# EAGLE design uSD_socket_breakout_rev_2 (EAGLE 6.5.0)
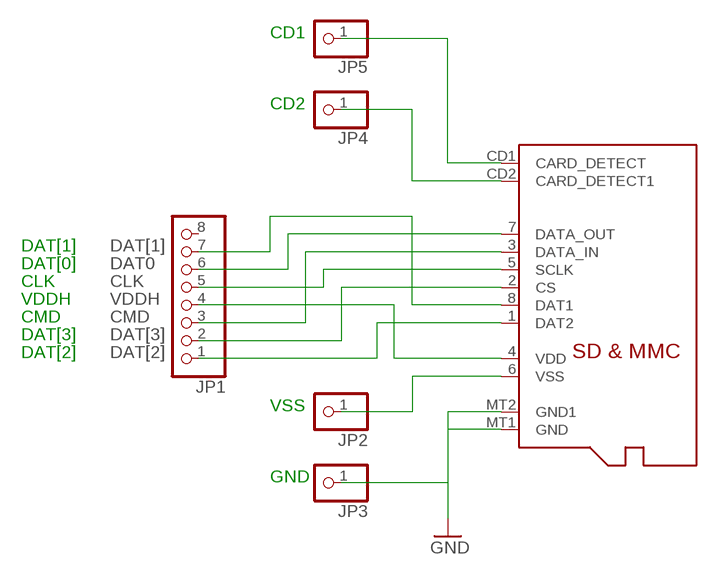
[diagram p0: schematic, sheet 1]

## Parts
JP1  PINHD-1X8CLEANBIG  [1X08-CLEANBIG]
JP2  PINHD-1X1CB  [1X01-CLEANBIG]
JP3  PINHD-1X1CB  [1X01-CLEANBIG]
JP4  PINHD-1X1CB  [1X01-CLEANBIG]
JP5  PINHD-1X1CB  [1X01-CLEANBIG]
U$1  MICROSD  [MICROSD]

## Nets
CLK: JP1.5 U$1.5(SCLK)
CMD: JP1.3 U$1.3(DATA_IN)
DAT0: JP1.6 U$1.7(DATA_OUT)
DAT[1]: JP1.7 U$1.8(DAT1)
DAT[2]: JP1.1 U$1.1(DAT2)
DAT[3]: JP1.2 U$1.2(CS)
GND: JP3.1 U$1.MT1(GND) U$1.MT2(GND1)
N$3: JP5.1 U$1.CD1(CARD_DETECT)
N$4: JP4.1 U$1.CD2(CARD_DETECT1)
VDDH: JP1.4 U$1.4(VDD)
VSS: JP2.1 U$1.6(VSS)
Unconnected: JP1.8

## Notes on the sheet
- CD1
- CD2
- DAT[1]
- DAT[0]
- CLK
- VDDH
- CMD
- DAT[3]
- DAT[2]
- VSS
- GND

## Library data of the parts
JP1 = adafruit:PINHD-1X8: PIN HEADER
JP2-JP5 = adafruit:PINHD-1X1: Pin header 1x1 for 0.1" spacing With round pins
U$1 = adafruit:MICROSD: Micro-SD / Transflash card holder with SPI pinout For the 3M # 2908-05WB-MG and/or 4UCON #19656 push-push type

## Board
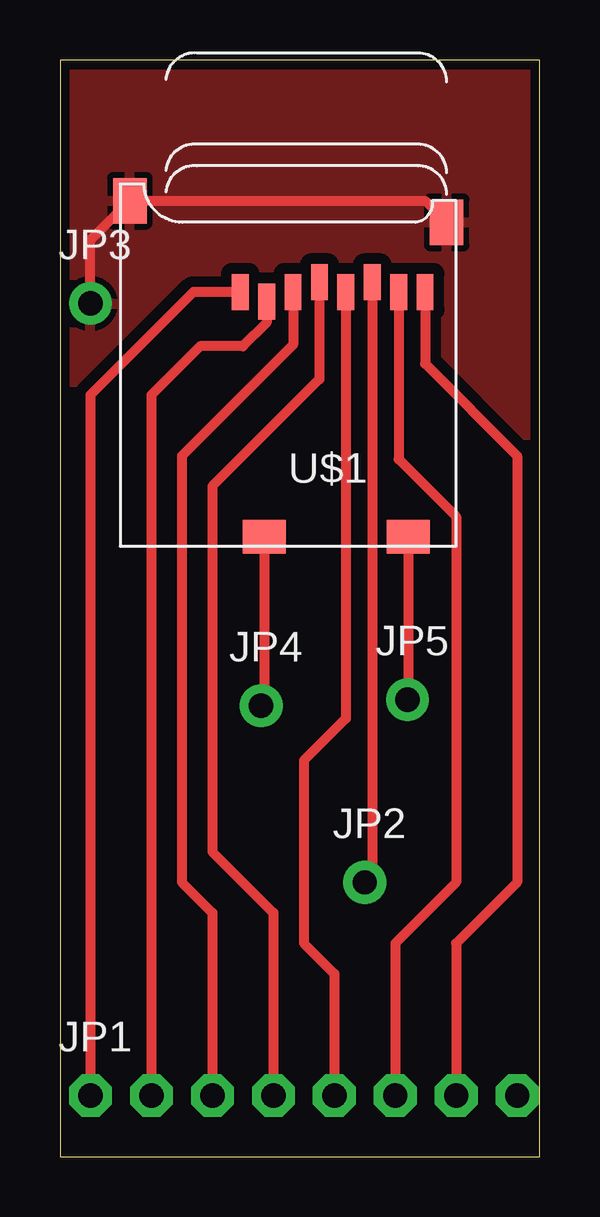
[diagram p1: board, top side]

Size 19.99 x 45.71 mm. Coordinates in mm from the lower left corner, seen from the top.
Outline: 0,0 19.99,0 19.99,45.71 0,45.71 0,0
Copper layers (1*16): Top 0.0178mm / dielectric 59mil / Bottom 0.0178mm
Design rules "epl-lpkf *": minimum track width 8mil, minimum drill 0.35mm, track to track 18mil, track to pad 18mil, pad to pad 18mil, via to via 18mil, smd to smd 8mil, copper to edge 15mil, drill to drill 15mil, minimum pad ring 8mil, minimum via ring 8mil, stop-mask expansion 3mil, vias tented up to drill 0mil, thermal gap 10mil

### Footprints (pad centres in the part's own frame; a part is rotated, then mirrored left to right if it is on the bottom)
1X08-CLEANBIG = drill 1.016 pad 1.778 octagon: 1 -8.89,0; 2 -6.35,0; 3 -3.81,0; 4 -1.27,0; 5 1.27,0; 6 3.81,0; 7 6.35,0; 8 8.89,0
1X01-CLEANBIG = drill 1.016 pad 1.778: 1 0,0
MICROSD = smd 0.7 x 1.5: 1 9,-10.64; 2 7.9,-10.24; 3 6.8,-10.64; 4 5.7,-11.04; 5 4.6,-10.64; 6 3.5,-11.04; 7 2.4,-10.64; 8 1.3,-10.64 | smd 1.8 x 1.4: CD1 2,-0.44; CD2 8,-0.44 | smd 1.4 x 1.9: MT1 0.4,-13.54; MT2 13.6,-14.44

### Placement (x,y rotation side)
JP1  10.16,2.54 0 top
JP2  12.7,11.43 0 top
JP3  1.27,35.56 0 top
JP4  8.38,18.8 0 top
JP5  14.48,19.05 0 top
U$1  16.51,25.4 180 top

### Tracks (layer width: path | path; a pad name or v marks a point on that pad's centre or on a via)
CLK
  Top 0.406: U$1.5 11.91,18.26 10.16,16.51 10.16,8.89 11.43,7.62 JP1.5
CMD
  Top 0.406: U$1.3 9.71,33.84 5.08,29.21 5.08,11.43 6.35,10.16 JP1.3
DAT0
  Top 0.406: U$1.7 14.11,29.07 16.51,26.67 16.51,11.43 13.97,8.89 JP1.6
DAT[1]
  Top 0.406: U$1.8 15.21,33.05 19.05,29.21 19.05,11.43 16.51,8.89 JP1.7
DAT[2]
  Top 0.406: U$1.1 5.56,36.04 1.27,31.75 JP1.1
DAT[3]
  Top 0.406: U$1.2 8.61,34.77 7.62,33.78 5.84,33.78 3.81,31.75 JP1.2
GND
  Top 0.406: U$1.MT1 15.21,39.84 U$1.MT2 1.27,38.2 JP3.1
  pour Top: 0,45.72 20.32,45.72 20.32,0 0,0
N$3
  Top 0.406: U$1.CD1 14.51,19.08 JP5.1
N$4
  Top 0.406: U$1.CD2 8.51,18.92 JP4.1
VDDH
  Top 0.406: U$1.4 10.81,32.4 6.35,27.94 6.35,12.7 8.89,10.16 JP1.4
VSS
  Top 0.406: U$1.6 13.01,11.74 JP2.1